# EAGLE design analog2 (EAGLE 6.5.0)
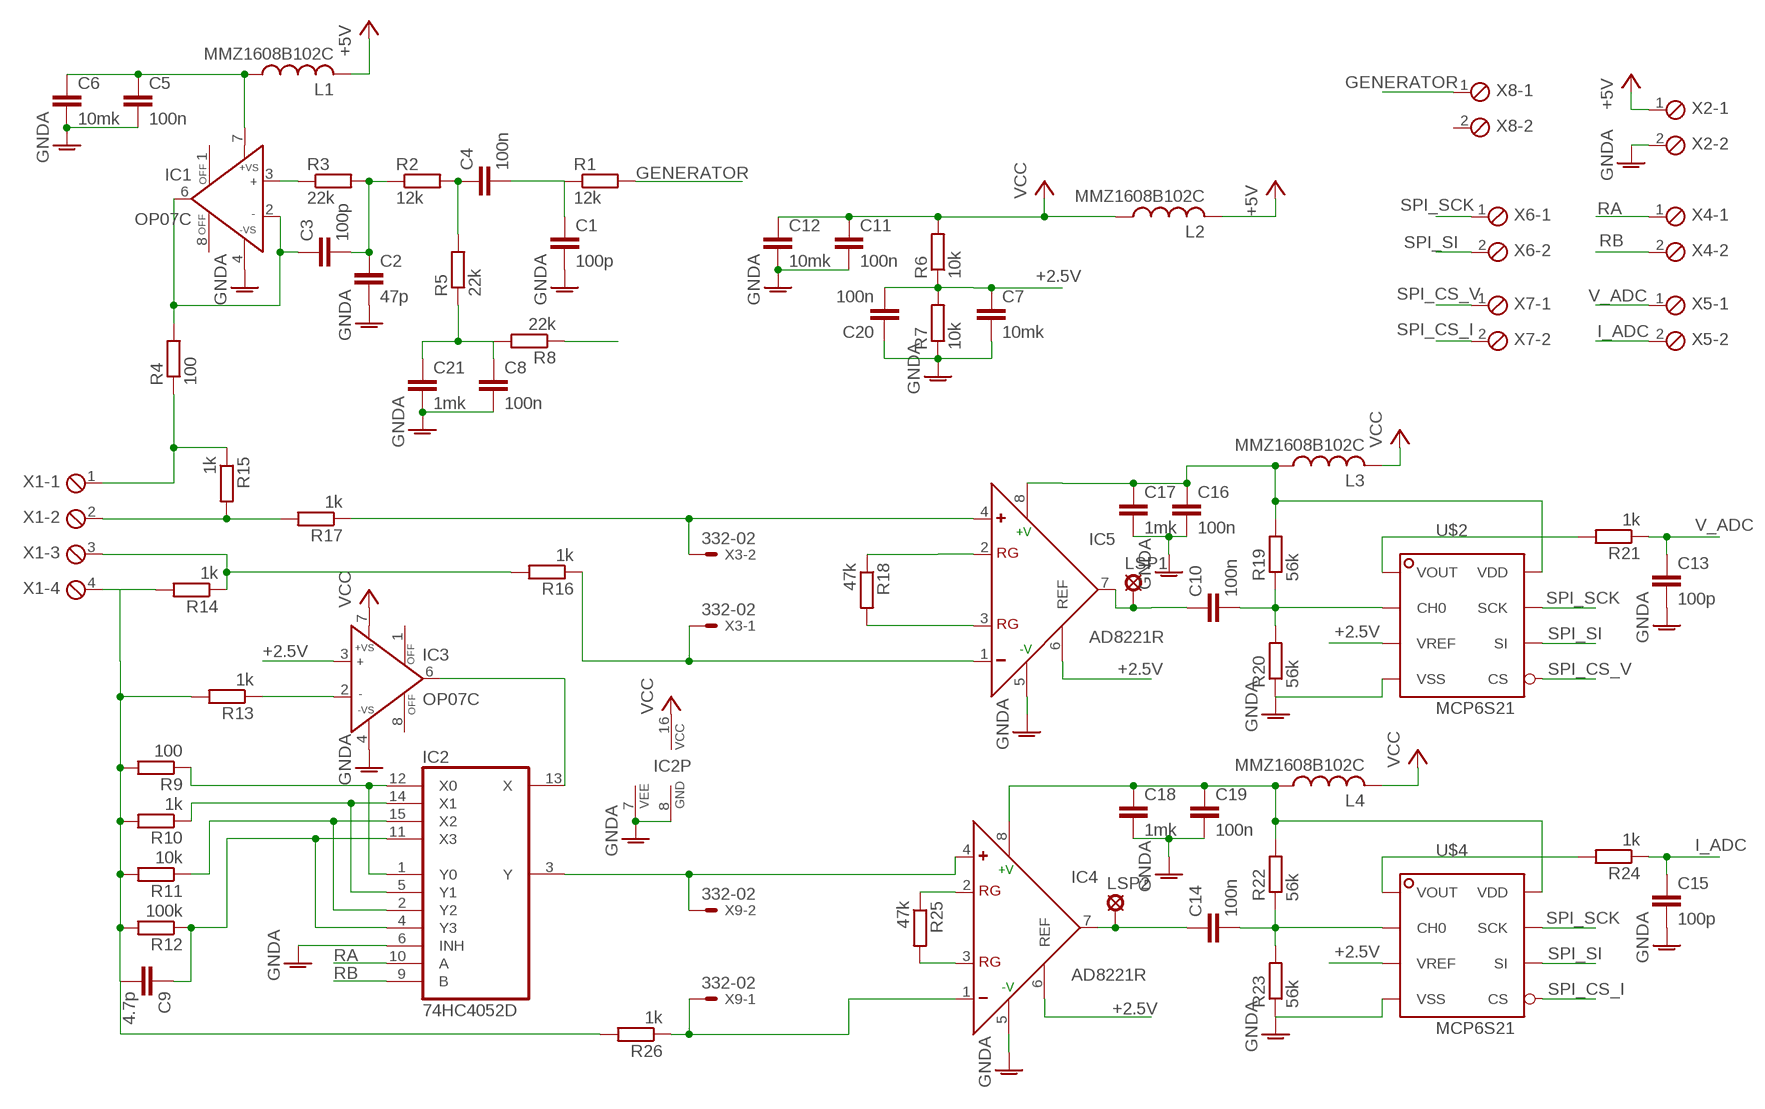
[diagram p0: schematic, sheet 1]

## Parts
C1  100p  C-EUC0805  [C0805]
C2  47p  C-EUC0805  [C0805]
C3  100p  C-EUC1206  [C1206]
C4  100n  C-EUC0603  [C0603]
C5  100n  C-EUC0603  [C0603]
C6  10mk  C-EUC0805  [C0805]
C7  10mk  C-EUC0805  [C0805]
C8  100n  C-EUC0603  [C0603]
C9  4.7p  C-EUC0805  [C0805]
C10  100n  C-EUC0603  [C0603]
C11  100n  C-EUC0603  [C0603]
C12  10mk  C-EUC0805  [C0805]
C13  100p  C-EUC0805  [C0805]
C14  100n  C-EUC0603  [C0603]
C15  100p  C-EUC0805  [C0805]
C16  100n  C-EUC0603  [C0603]
C17  1mk  C-EUC0603  [C0603]
C18  1mk  C-EUC0603  [C0603]
C19  100n  C-EUC0603  [C0603]
C20  100n  C-EUC0603  [C0603]
C21  1mk  C-EUC0603  [C0603]
IC1  OP07C  AD817  [SO8]
IC2  74HC4052D  4052D  [SO16]
IC3  OP07C  AD817  [SO8]
IC4  AD8221R  [SO8]
IC5  AD8221R  [SO8]
L1  MMZ1608B102C  L-US  [R0603]
L2  MMZ1608B102C  L-US  [R0603]
L3  MMZ1608B102C  L-US  [R0603]
L4  MMZ1608B102C  L-US  [R0603]
LSP1  LSP10  [LSP10]
LSP2  LSP10  [LSP10]
R1  12k  R-EU_R0805  [R0805]
R2  12k  R-EU_R0805  [R0805]
R3  22k  R-EU_R0805  [R0805]
R4  100  R-EU_R0805  [R0805]
R5  22k  R-EU_R0805  [R0805]
R6  10k  R-EU_R0805  [R0805]
R7  10k  R-EU_R0805  [R0805]
R8  22k  R-EU_R0805  [R0805]
R9  100  R-EU_R0805  [R0805]
R10  1k  R-EU_R0805  [R0805]
R11  10k  R-EU_R0805  [R0805]
R12  100k  R-EU_R0805  [R0805]
R13  1k  R-EU_R0805  [R0805]
R14  1k  R-EU_R0805  [R0805]
R15  1k  R-EU_R0805  [R0805]
R16  1k  R-EU_R0805  [R0805]
R17  1k  R-EU_R0805  [R0805]
R18  47k  R-EU_R0805  [R0805]
R19  56k  R-EU_R0805  [R0805]
R20  56k  R-EU_R0805  [R0805]
R21  1k  R-EU_R0805  [R0805]
R22  56k  R-EU_R0805  [R0805]
R23  56k  R-EU_R0805  [R0805]
R24  1k  R-EU_R0805  [R0805]
R25  47k  R-EU_R0805  [R0805]
R26  1k  R-EU_R0805  [R0805]
U$2  MCP6S21  [SO8]
U$4  MCP6S21  [SO8]
X1  MPT4  [4POL254]
X2  MPT2  [2POL254]
X3  332-02  [332-02]
X4  MPT2  [2POL254]
X5  MPT2  [2POL254]
X6  MPT2  [2POL254]
X7  MPT2  [2POL254]
X8  MPT2  [2POL254]
X9  332-02  [332-02]

## Nets
+2.5V: C7.1 C20.2 IC3.3(IN+) IC4.6(REF) IC5.6(REF) R6.1 R7.2 R8.1 U$2.3(VREF) U$4.3(VREF)
+5V: L1.2 L2.2 X2.1
GENERATOR: R1.2 X8.1
GNDA: C1.2 C2.2 C5.2 C6.2 C7.2 C8.2 C11.2 C12.2 C13.2 C15.2 C16.2 C17.2 C18.2 C19.2 C20.1 C21.2 IC1.4(-VS) IC2.6(INH) IC2.7(VEE) IC2.8(GND) IC3.4(-VS) IC4.5(-V) IC5.5(-V) R7.1 R20.1 R23.1 U$2.4(VSS) U$4.4(VSS) X2.2
I_ADC: C15.1 R24.1 X5.2
N$1: IC5.4(+) R17.1 X3.2
N$2: C1.1 C4.2 R1.1
N$3: C2.1 C3.2 R2.1 R3.2
N$4: C4.1 R2.2 R5.2
N$5: C3.1 IC1.2(IN-) IC1.6(OUT) R4.2
N$6: IC1.3(IN+) R3.1
N$7: C5.1 C6.1 IC1.7(+VS) L1.1
N$8: IC3.2(IN-) R13.1
N$9: IC4.3(RG) R25.2
N$10: C8.1 C21.1 R5.1 R8.2
N$11: IC2.13(X) IC3.6(OUT)
N$12: IC2.1(Y0) IC2.12(X0) R9.1
N$13: IC2.5(Y1) IC2.14(X1) R10.1
N$14: IC2.2(Y2) IC2.15(X2) R11.1
N$15: C9.1 IC2.4(Y3) IC2.11(X3) R12.1
N$16: R14.1 R16.2 X1.3
N$17: R15.2 R17.2 X1.2
N$18: C9.2 R9.2 R10.2 R11.2 R12.2 R13.2 R14.2 R26.2 X1.4
N$19: R4.1 R15.1 X1.1
N$20: C10.1 IC5.7(OUT) LSP1.MP
N$21: IC4.2(RG) R25.1
N$22: IC4.1(-) R26.1 X9.1
N$23: IC5.3(RG) R18.2
N$24: IC5.2(RG) R18.1
N$25: C14.2 R22.1 R23.2 U$4.2(CH0)
N$26: R24.2 U$4.1(VOUT)
N$27: C10.2 R19.1 R20.2 U$2.2(CH0)
N$28: R21.2 U$2.1(VOUT)
N$29: C14.1 IC4.7(OUT) LSP2.MP
N$30: IC2.3(Y) IC4.4(+) X9.2
N$32: C16.1 C17.1 IC5.8(+V) L3.1 R19.2 U$2.8(VDD)
N$34: C18.1 C19.1 IC4.8(+V) L4.1 R22.2 U$4.8(VDD)
RA: IC2.10(A) X4.1
RB: IC2.9(B) X4.2
SPI_CS_I: U$4.5(CS) X7.2
SPI_CS_V: U$2.5(CS) X7.1
SPI_SCK: U$2.7(SCK) U$4.7(SCK) X6.1
SPI_SI: U$2.6(SI) U$4.6(SI) X6.2
V_ADC: C13.1 R21.1 X5.1
V_IN+: IC5.1(-) R16.1 X3.1
VCC: C11.1 C12.1 IC2.16(VCC) IC3.7(+VS) L2.1 L3.2 L4.2 R6.2
Unconnected: IC1.1(OFF) IC1.8(OFF) IC3.1(OFF) IC3.8(OFF) X8.2

## Library data of the parts
C1-C21 = rcl:C-EU: CAPACITOR, European symbol
IC1 IC3 = analog-devices:AD817: High Speed, Low Power Wide Supply Range Amplifier Source: http://www.analog.com/static/imported-files/data_sheets/AD817.pdf; MF: ALTERA CORPORATION; MPN: AD817ARZ; OC_FARNELL: 1660992; OC_NEWARK: 88H0179
IC2 = 40xx:4052: Dual 4-channel ANALOG MULTIPLEXER
IC4 IC5 = balmer:AD8221: Low Cost, Low Power, Instrumentation Amplifier Source: http://www.analog.com/UploadedFiles/Data_Sheets/37793330023930AD620_e.pdf; MPN: AD620AR; OC_FARNELL: 1464424; OC_NEWARK: 05F7109
L1-L4 = rcl:L-US: INDUCTOR, American symbol
LSP1 LSP2 = solpad:LSP10: SOLDER PAD drill 1.0 mm, distributor Buerklin, 12H555
R1-R26 = rcl:R-EU_: RESISTOR, European symbol
U$2 U$4 = balmer:MCP6S21: Single-Ended, Rail-to-Rail I/O, Low Gain PGA
X1 = con-phoenix-254:MPT4: PHOENIX CONNECTOR; OC_FARNELL: unknown; OC_NEWARK: unknown
X2 X4-X8 = con-phoenix-254:MPT2: PHOENIX CONNECTOR; OC_FARNELL: unknown; OC_NEWARK: unknown
X3 X9 = con-garry:332-02: 2 Pin - 2mm Dual Row Source: www.mpe-connector.de / garry_shortform_2012.pdf

## Board
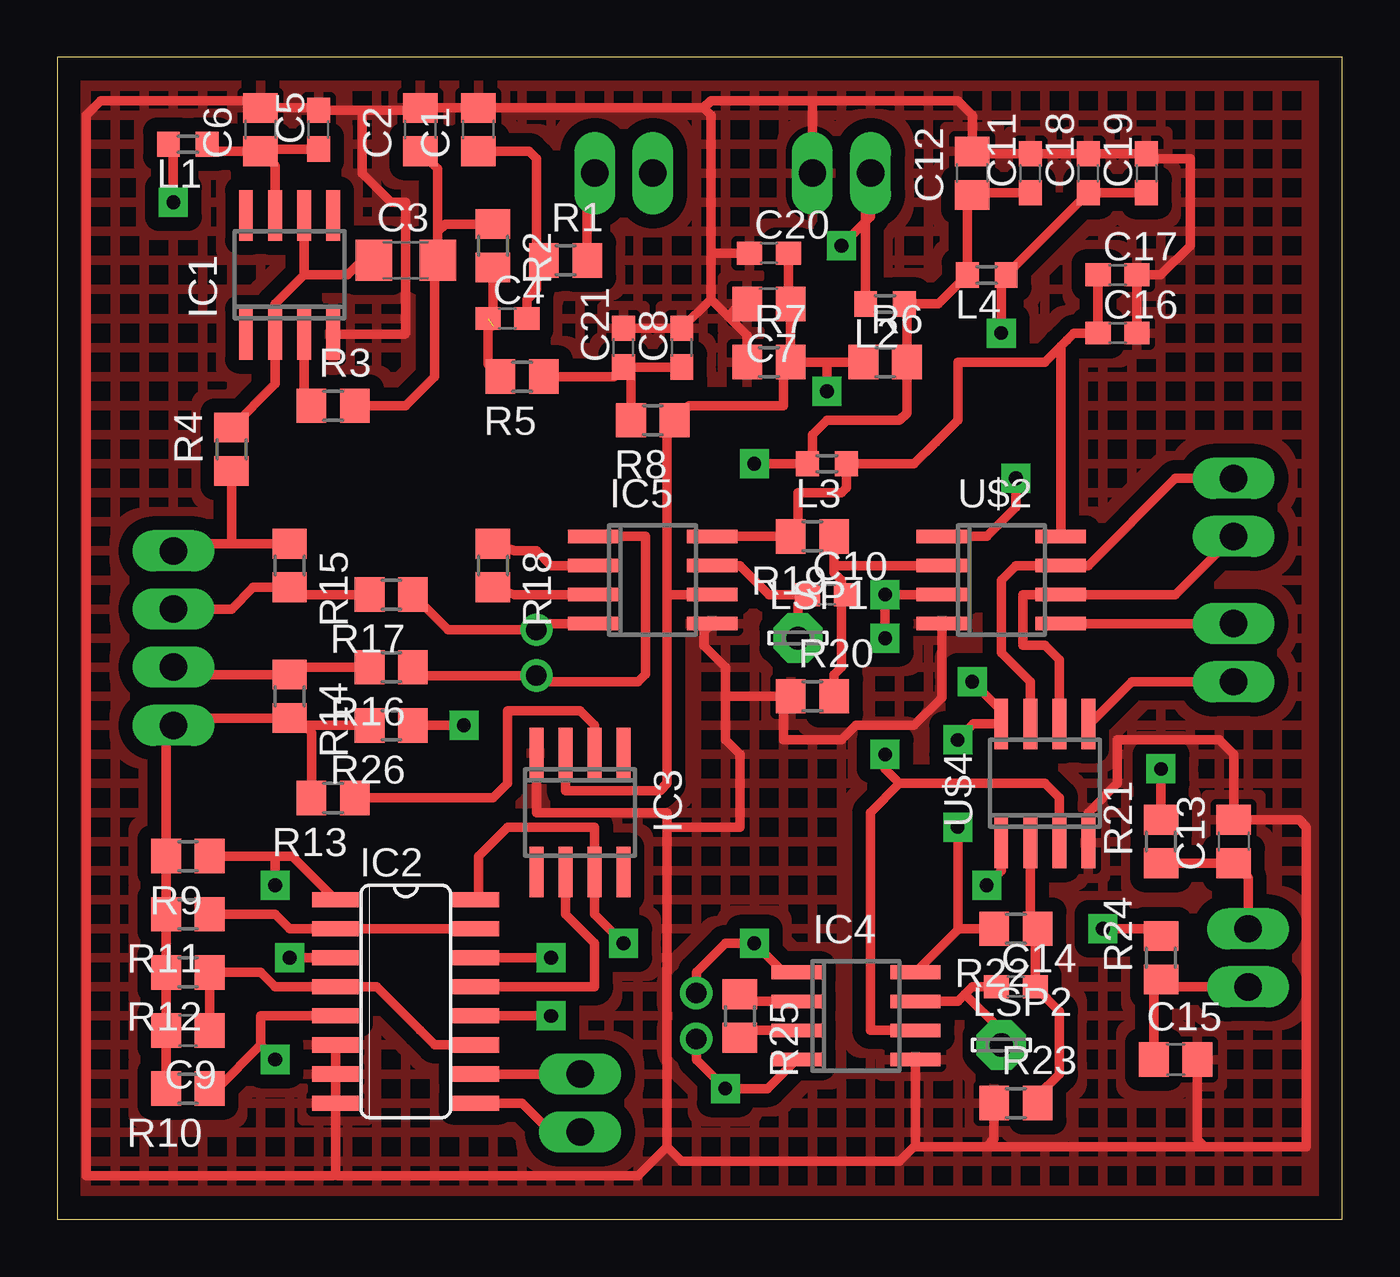
[diagram p1: board, top side]
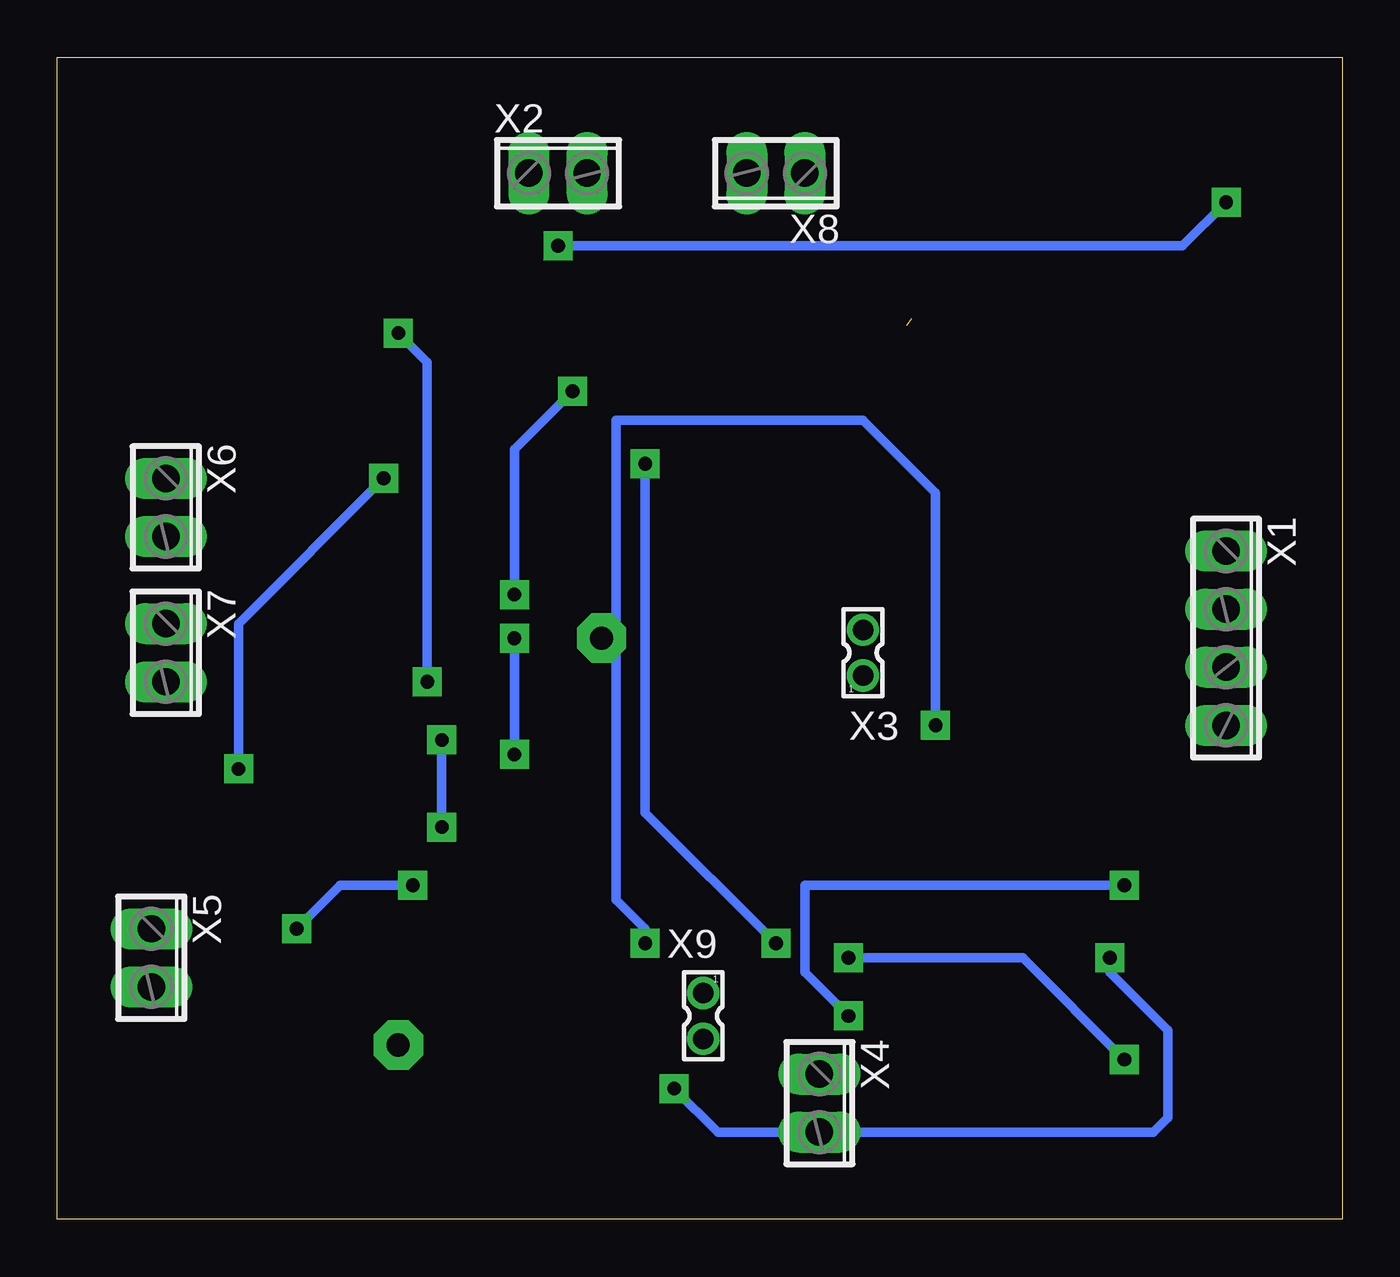
[diagram p2: board, bottom side, seen from below]

Size 56.19 x 50.79 mm. Coordinates in mm from the lower left corner, seen from the top.
Outline: 0,0 56.19,0 56.19,50.79 0,50.79 0,0
Copper layers (1*16): Top 0.035mm / dielectric 1.5mm / Bottom 0.035mm
Design rules "default": minimum track width 10mil, minimum drill 24mil, track to track 8mil, track to pad 8mil, pad to pad 8mil, via to via 8mil, smd to smd 8mil, copper to edge 40mil, drill to drill 8mil, minimum pad ring 10mil, minimum via ring 8mil, stop-mask expansion 4mil, vias tented up to drill 0mil, thermal gap 10mil

### Footprints (pad centres in the part's own frame; a part is rotated, then mirrored left to right if it is on the bottom)
C0805 = smd 1.3 x 1.5: 1 -0.95,0; 2 0.95,0
C1206 = smd 1.6 x 1.8: 1 -1.4,0; 2 1.4,0
C0603 = smd 1.1 x 1: 1 -0.85,0; 2 0.85,0
SO8 = smd 0.6 x 2.2: 1 -1.905,-2.6; 2 -0.635,-2.6; 3 0.635,-2.6; 4 1.905,-2.6; 5 1.905,2.6; 6 0.635,2.6; 7 -0.635,2.6; 8 -1.905,2.6
SO16 = smd 0.66 x 2.032: 1 -4.445,-3.073; 2 -3.175,-3.073; 3 -1.905,-3.073; 4 -0.635,-3.073; 5 0.635,-3.073; 6 1.905,-3.073; 7 3.175,-3.073; 8 4.445,-3.073; 9 4.445,3.073; 10 3.175,3.073; 11 1.905,3.073; 12 0.635,3.073; 13 -0.635,3.073; 14 -1.905,3.073; 15 -3.175,3.073; 16 -4.445,3.073
R0603 = smd 1 x 1.1: 1 -0.85,0; 2 0.85,0
LSP10 = drill 1.016 pad 2.159 octagon: MP 0,0
R0805 = smd 1.3 x 1.5: 1 -0.95,0; 2 0.95,0
4POL254 = drill 1.2 long: 1 -3.81,0; 2 -1.27,0; 3 1.27,0; 4 3.81,0
2POL254 = drill 1.2 long: 1 -1.27,0; 2 1.27,0
332-02 = drill 0.9 pad 1.27: 1 0,-1; 2 0,1

### Placement (x,y rotation side)
C1  18.41,47.62 90 top
C2  15.88,47.62 90 top
C3  15.24,41.91 0 top
C4  19.68,39.37 0 top
C5  11.43,47.62 90 top
C6  8.89,47.62 90 top
C7  31.11,40.01 180 top
C8  27.3,38.1 90 top
C9  5.71,8.26 180 top
C10  33.66,27.3 0 top
C11  42.55,45.72 90 top
C12  40.01,45.72 90 top
C13  51.44,16.51 90 top
C14  41.91,10.16 0 top
C15  48.9,6.99 0 top
C16  46.35,38.73 0 top
C17  46.35,41.27 0 top
C18  45.09,45.72 90 top
C19  47.62,45.72 90 top
C20  31.11,42.23 0 top
C21  24.77,38.1 90 top
IC1  10.16,41.27 0 top
IC2  15.24,9.53 270 top
IC3  22.86,17.78 180 top
IC4  34.92,8.89 270 top
IC5  26.04,27.94 270 top
L1  5.71,46.99 180 top
L2  36.2,40.01 180 top
L3  33.66,33.02 180 top
L4  40.64,41.27 180 top
LSP1  32.38,25.4 0 top
LSP2  41.27,7.62 0 top
R1  22.23,41.91 0 top
R2  19.05,42.55 270 top
R3  12.06,35.56 0 top
R4  7.62,33.66 90 top
R5  20.32,36.83 180 top
R6  36.2,37.47 0 top
R7  31.11,37.47 0 top
R8  26.04,34.92 180 top
R9  5.71,15.88 180 top
R10  5.71,5.71 180 top
R11  5.71,13.34 180 top
R12  5.71,10.79 180 top
R13  12.06,18.41 180 top
R14  10.16,22.86 270 top
R15  10.16,28.57 270 top
R16  14.61,24.13 180 top
R17  14.61,27.3 180 top
R18  19.05,28.57 270 top
R19  33.02,29.84 180 top
R20  33.02,22.86 0 top
R21  48.26,16.51 90 top
R22  41.91,12.7 180 top
R23  41.91,5.08 0 top
R24  48.26,11.43 90 top
R25  29.84,8.89 270 top
R26  14.61,21.59 180 top
U$2  41.27,27.94 270 top
U$4  43.18,19.05 0 top
X1  5.08,25.4 270 bottom
X2  34.29,45.72 0 bottom
X3  20.95,24.77 0 bottom
X4  22.86,5.08 270 bottom
X5  52.07,11.43 270 bottom
X6  51.44,31.11 270 bottom
X7  51.44,24.77 270 bottom
X8  24.77,45.72 180 bottom
X9  27.94,8.89 180 bottom

### Tracks (layer width: path | path; a pad name or v marks a point on that pad's centre or on a via)
+2.5V  (via drill 0.6 pad 1.27)
  Top 0.406: R7.2 33.66,37.47 | 33.66,37.47 R6.1 | R7.2 31.75,37.15 31.75,35.56 29.21,35.56 27.62,35.56 R8.1 26.67,34.61 26.67,27.3 | R7.2 C7.1 31.96,40.1 C20.2 | IC5.6 26.67,27.3 | IC3.3 22.23,18.73 26.35,18.73 26.67,19.05 26.67,27.3 | U$4.3 43.81,18.41 43.18,19.05 36.83,19.05 | 36.83,19.05 35.56,17.78 35.56,8.26 IC4.6 | v36.2,25.4 36.2,26.67 v36.2,27.3 U$2.3 | v36.2,20.32 36.2,19.68 36.83,19.05 | v33.66,36.2 33.66,37.47
  Bottom 0.406: v36.2,25.4 v36.2,20.32 | v36.2,27.3 36.2,33.66 v33.66,36.2
+5V  (via drill 0.6 pad 1.27)
  Top 0.406: L2.2 35.34,45.51 X2.1 35.56,43.81 v34.29,42.55 | v5.08,44.45 5.08,46.77 L1.2
  Bottom 0.406: v34.29,42.55 6.99,42.55 v5.08,44.45
GENERATOR
  Top 0.406: R1.2 23.18,45.4 X8.1
GNDA
  Top 0.406: IC1.4 15.18,38.67 15.24,38.73 15.24,44.45 14.61,44.45 13.34,45.72 13.34,48.48 | 13.34,48.48 C5.2 11.33,48.58 C6.2 8.57,48.9 1.91,48.9 1.27,48.26 1.27,1.91 12.06,1.91 12.17,2.01 | 13.34,48.48 15.78,48.48 C2.2 C1.2 28.26,48.58 | C21.2 C8.2 28.57,40.22 | 28.26,48.58 28.57,48.26 28.57,41.91 | 28.57,41.91 28.57,40.22 | X2.2 33.02,48.9 | 33.02,48.9 28.58,48.9 28.26,48.58 | IC2.6 IC2.7 IC2.8 12.17,2.01 | 33.02,48.9 39.37,48.9 40.01,48.26 C12.2 40.1,46.57 C11.2 C18.2 C19.2 47.84,46.35 49.53,46.35 49.53,42.55 48.26,41.27 C17.2 C16.2 | R7.1 30.16,38.63 29.32,39.48 | 29.32,39.48 28.57,40.22 | C7.2 29.84,40.01 29.32,39.48 | IC3.4 20.95,17.78 26.67,17.78 26.67,17.14 | 26.67,17.14 26.67,3.17 | 26.67,3.17 25.4,1.91 12.27,1.91 12.17,2.01 | 29.21,22.86 29.21,24.13 28.28,25.06 28.28,25.7 28.3,25.7 IC5.5 | 29.21,22.86 29.21,22.23 29.21,20.95 29.84,20.32 29.84,17.14 26.67,17.14 | IC4.5 37.52,3.23 | 37.52,3.23 36.83,2.54 27.3,2.54 26.67,3.17 | U$4.4 45.09,17.78 46.35,19.05 46.35,20.95 50.8,20.95 51.44,20.32 C13.2 54.3,17.46 54.61,17.14 54.61,3.17 50.16,3.17 | 50.16,3.17 40.64,3.17 | 40.64,3.17 37.59,3.17 37.52,3.23 | C15.2 49.84,3.5 50.16,3.17 | R23.1 40.96,3.5 40.64,3.17 | 29.21,22.86 R20.1 31.75,22.54 31.75,20.95 34.29,20.95 34.92,21.59 37.47,21.59 38.67,22.8 U$2.4 | C20.1 28.57,42.23 28.57,41.91
  pour Top (isolate 0.61, hatched): 0,0 56.52,0 56.52,50.8 0,50.8
I_ADC
  Top 0.406: C15.1 47.95,10.16 R24.1 48.58,10.16 X5.2
N$1
  Top 0.406: IC5.4 21.23,26.04 X3.2 17.09,25.77 R17.1
N$2
  Top 0.406: C4.2 20.54,40.22 20.95,40.64 20.95,41.59 R1.1 20.95,42.23 20.95,46.35 20.64,46.67 C1.1
N$3
  Top 0.406: 16.64,43.18 C3.2 16.51,41.78 16.51,36.83 15.24,35.56 R3.2 | 16.64,43.18 16.64,45.91 C2.1 | R2.1 16.95,43.49 16.64,43.18
N$4  (1 unrouted)
  Top 0.406: 19.05,39.05 R2.2 | C4.1 18.84,37.37 R5.2
N$5
  Top 0.406: 10.79,41.27 9.53,40.01 IC1.2 9.53,36.51 R4.2 | 10.79,41.27 IC1.6 | C3.1 13.34,41.91 12.7,41.27 10.79,41.27
N$6
  Top 0.406: IC1.3 10.79,35.88 R3.1
N$7
  Top 0.406: IC1.7 9.53,46.04 C6.1 | C5.1 8.99,46.77 C6.1 | C6.1 6.88,46.67 L1.1
N$8
  Top 0.406: IC3.2 23.5,21.59 22.86,22.23 19.68,22.23 19.68,19.05 19.05,18.41 15.88,18.41 R13.1
N$9
  Top 0.406: IC4.3 30.16,8.26 R25.2
N$10
  Top 0.406: R5.1 24.34,36.83 C21.1 | C21.1 C8.1 | 25.09,36.93 C21.1 | R8.2 25.09,36.93 | 25.09,36.93 C21.1
N$11
  Top 0.406: IC2.13 23.5,10.16 23.5,12.06 22.23,13.34 IC3.6
N$12  (via drill 0.6 pad 1.27)
  Top 0.406: R9.1 9.53,15.88 | 9.53,15.88 10.26,15.88 IC2.1 | IC2.12 v21.59,8.89 | v9.53,14.61 9.53,15.88
  Bottom 0.406: v21.59,8.89 23.5,10.79 23.5,14.61 v9.53,14.61
N$13  (via drill 0.6 pad 1.27)
  Top 0.406: R10.1 6.99,5.71 8.89,7.62 | 8.89,7.62 8.89,8.89 IC2.5 | IC2.14 v21.59,11.43 | v9.53,6.99 8.89,7.62
  Bottom 0.406: v21.59,11.43 13.97,11.43 v9.53,6.99
N$14
  Top 0.406: R11.1 9.53,13.34 10.16,12.7 IC2.2 IC2.15
N$15
  Top 0.406: C9.1 R12.1 8.89,10.79 9.53,10.16 IC2.4 13.97,10.16 15.88,8.26 16.51,7.62 IC2.11
N$16
  Top 0.406: X1.3 5.4,23.81 R14.1 10.48,24.13 R16.2
N$17
  Top 0.406: X1.2 7.62,26.67 8.57,27.62 R15.2 10.48,27.3 R17.2
N$18
  Top 0.406: R26.2 10.79,21.59 | 10.79,21.59 10.48,21.59 R14.2 5.08,21.91 X1.4 4.76,21.27 R9.2 R11.2 R12.2 C9.2 R10.2 | R13.2 11.12,21.27 10.79,21.59
N$19
  Top 0.406: R15.1 7.62,29.52 | 7.62,29.52 5.39,29.52 X1.1 | R4.1 7.62,29.52
N$20
  Top 0.406: IC5.7 29.84,28.57 31.11,27.3 C10.1 32.38,26.89 LSP1.MP
N$21
  Top 0.406: IC4.2 30.16,9.53 R25.1
N$22  (via drill 0.6 pad 1.27)
  Top 0.406: IC4.1 31.75,10.79 v30.48,12.06 29.21,12.06 27.94,10.79 X9.1 | v17.78,21.59 R26.1
  Bottom 0.406: v30.48,12.06 30.48,12.7 31.75,13.97 31.75,34.92 20.95,34.92 17.78,31.75 v17.78,21.59
N$23
  Top 0.406: IC5.3 20,27.3 R18.2
N$24
  Top 0.406: IC5.2 21.59,28.57 20.95,29.21 20,29.21 R18.1
N$25
  Top 0.406: 42.86,10.06 C14.2 | C14.2 42.76,12.6 R22.1 42.55,13.02 U$4.2 | R23.2 42.86,5.39 43.81,6.35 43.81,9.11 C14.2
N$26  (via drill 0.6 pad 1.27)
  Top 0.406: U$4.1 41.27,15.24 v40.64,14.61 | v45.72,12.7 47.94,12.7 R24.2
  Bottom 0.406: v40.64,14.61 43.81,14.61 v45.72,12.7
N$27
  Top 0.406: R19.1 33.97,28.57 | 33.97,28.57 33.97,28.26 34.29,27.94 34.29,27.52 C10.2 34.29,27.09 34.29,24.13 33.97,23.81 R20.2 | U$2.2 35.77,28.57 33.97,28.57
N$28  (via drill 0.6 pad 1.27)
  Top 0.406: R21.2 v48.26,19.68 | v41.91,32.38 41.91,31.11 40.64,29.84 U$2.1
  Bottom 0.406: v48.26,19.68 48.26,26.04 v41.91,32.38
N$29
  Top 0.406: C14.1 40.01,10.16 39.69,9.84 | 39.69,9.84 39.37,9.53 IC4.7 | LSP2.MP 41.27,8.26 39.69,9.84
N$30  (via drill 0.6 pad 1.27)
  Top 0.406: IC2.3 v10.16,11.43 | IC4.4 31.05,5.71 v29.21,5.71 27.94,6.99 X9.2
  Bottom 0.406: v10.16,11.43 10.16,10.79 7.62,8.26 7.62,4.45 8.26,3.81 27.3,3.81 v29.21,5.71
N$32
  Top 0.406: IC5.8 R19.2 32.38,30.16 32.38,31.75 34.29,31.75 34.51,31.96 L3.1 37.47,33.02 38.42,33.97 39.37,34.92 39.37,37.47 43.18,37.47 44.13,38.42 | C17.1 C16.1 44.45,38.73 44.13,38.42 | U$2.8 43.88,38.16 44.13,38.42
N$34  (via drill 0.6 pad 1.27)
  Top 0.406: C19.1 C18.1 L4.1 41.27,41.06 v41.27,38.73 | R22.2 39.43,12.7 | 39.43,12.7 IC4.8 | v39.37,20.95 40.06,21.65 U$4.8 41.27,22.23 v40.01,23.5 | v39.37,17.14 39.37,12.76 39.43,12.7
  Bottom 0.406: v39.37,20.95 v39.37,17.14 | v40.01,23.5 40.01,37.47 v41.27,38.73
RA
  Top 0.406: IC2.10 22.23,6.35 X4.1
RB
  Top 0.406: IC2.9 20.32,5.08 21.59,3.81 X4.2
SPI_CS_I
  Top 0.406: U$4.5 45.15,21.65 46.99,23.5 X7.2
SPI_CS_V
  Top 0.406: U$2.5 X7.1
SPI_SCK
  Top 0.406: U$4.7 42.55,23.5 41.27,24.77 41.27,27.94 41.91,28.57 U$2.7 45.09,28.57 48.9,32.38 X6.1
SPI_SI
  Top 0.406: U$4.6 43.81,24.45 43.18,25.08 42.23,25.08 42.23,27.3 U$2.6 48.9,27.3 X6.2
V_ADC
  Top 0.406: R21.1 C13.1 52.07,14.93 X5.1
V_IN+
  Top 0.406: IC5.1 25.72,29.84 25.72,23.81 25.4,23.5 21.23,23.5 X3.1 15.92,23.77 R16.1
VCC  (via drill 0.6 pad 1.27)
  Top 0.406: IC2.16 18.41,14.07 18.41,15.88 19.68,17.14 23.5,17.14 IC3.7 23.5,13.34 v24.77,12.06 | 39.79,44.55 C12.1 | C11.1 40.1,44.87 C12.1 | 39.79,44.55 L4.2 38.52,40.01 L2.1 37.15,39.91 R6.2 37.15,35.24 36.83,34.92 33.66,34.92 33.02,34.29 33.02,33.23 L3.2 v30.48,33.02 | 39.79,44.55 C12.1
  Bottom 0.406: v30.48,33.02 30.48,17.78 v24.77,12.06